# EAGLE design Backplane_extRefV3 (EAGLE 6.6.0)
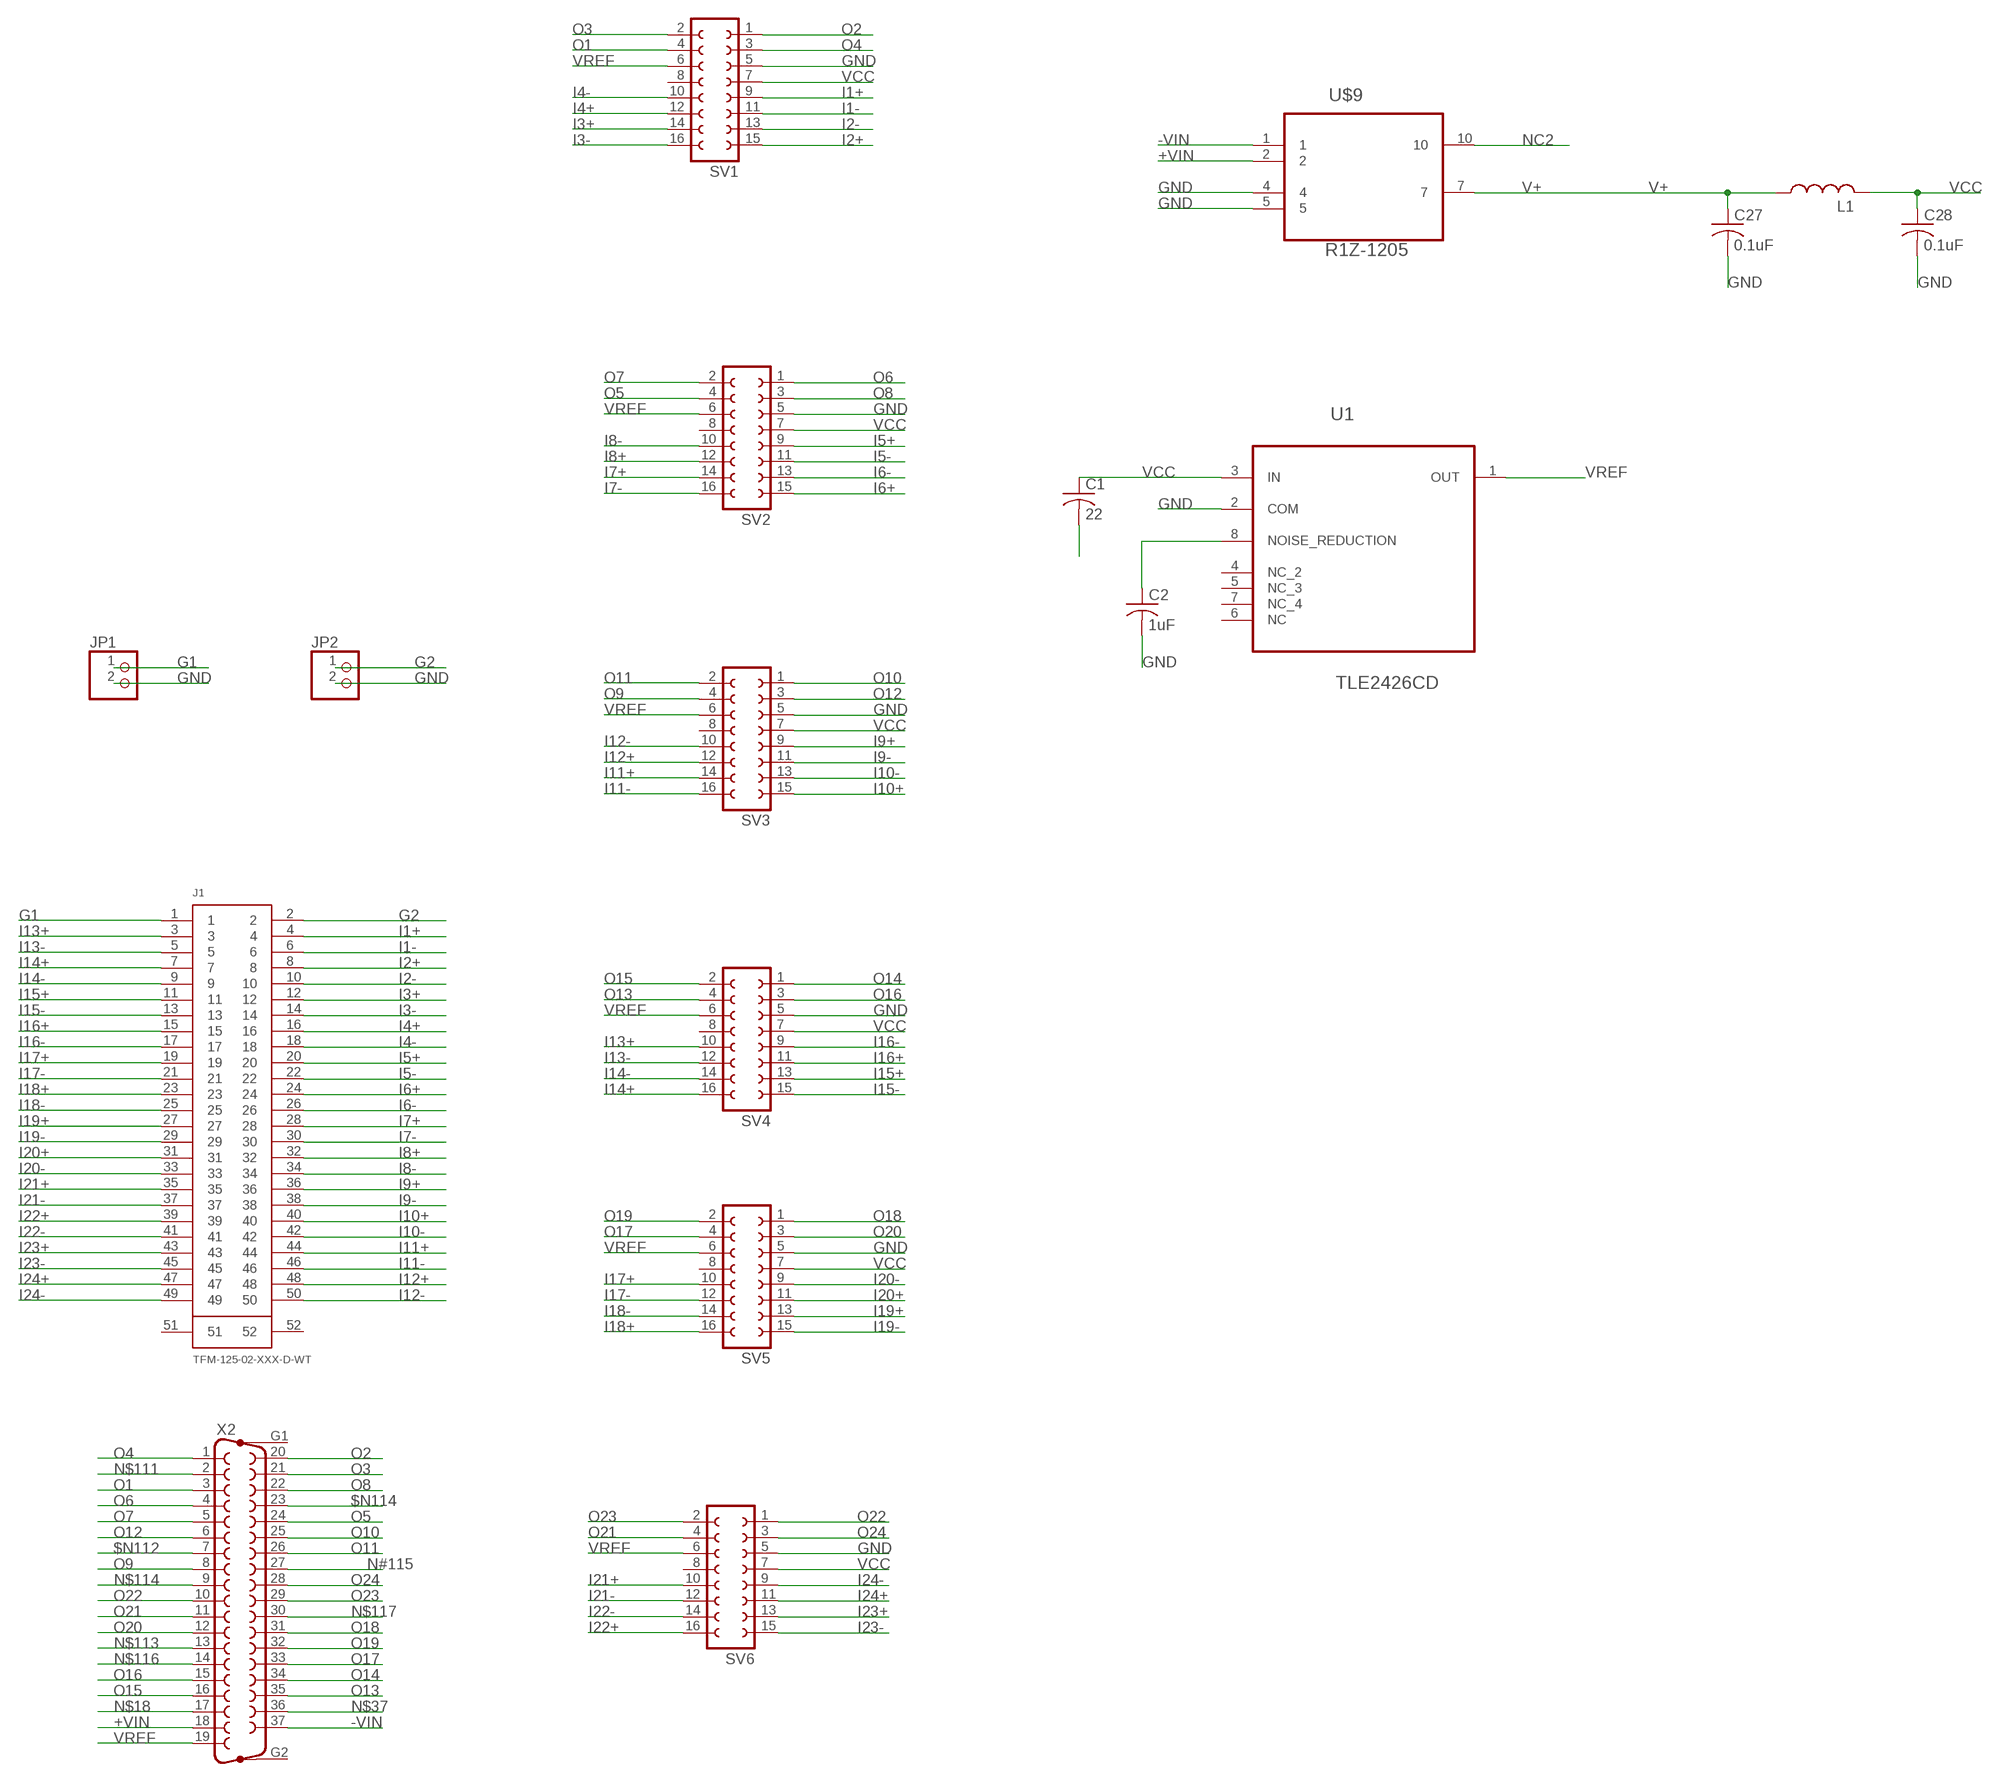
[diagram p0: schematic, sheet 1]

## Parts
C1  22  C-USC0805  [C0805]
C2  1uF  C-USC0805  [C0805]
C27  0.1uF  C-USC0805  [C0805]
C28  0.1uF  C-USC0805  [C0805]
J1  TFM-125-02-XXX-D-WT  [TFM-125-02-XXX-D-WT]
JP1  PINHD-1X2  [1X02]
JP2  PINHD-1X2  [1X02]
L1  L-USL3225M  [L3225M]
SV1  FE08-2  [FE08-2]
SV2  FE08-2  [FE08-2]
SV3  FE08-2  [FE08-2]
SV4  FE08-2  [FE08-2]
SV5  FE08-2  [FE08-2]
SV6  FE08-2  [FE08-2]
U1  TLE2426CD  [SOIC127P600X175-8N]
U$9  R1Z-1205  [R1Z-1205]
X2  F37HP  [F37HP]

## Nets
$N112: X2.7
$N114: X2.23
+VIN: U$9.2 X2.18
-VIN: U$9.1 X2.37
G1: J1.1 JP1.1
G2: J1.2 JP2.1
GND: C1.2 C2.2 C27.2 C28.2 JP1.2 JP2.2 SV1.5 SV2.5 SV3.5 SV4.5 SV5.5 SV6.5 U1.2(COM) U$9.4 U$9.5
I1+: J1.4 SV1.9
I1-: J1.6 SV1.11
I2+: J1.8 SV1.15
I2-: J1.10 SV1.13
I3+: J1.12 SV1.14
I3-: J1.14 SV1.16
I4+: J1.16 SV1.12
I4-: J1.18 SV1.10
I5+: J1.20 SV2.9
I5-: J1.22 SV2.11
I6+: J1.24 SV2.15
I6-: J1.26 SV2.13
I7+: J1.28 SV2.14
I7-: J1.30 SV2.16
I8+: J1.32 SV2.12
I8-: J1.34 SV2.10
I9+: J1.36 SV3.9
I9-: J1.38 SV3.11
I10+: J1.40 SV3.15
I10-: J1.42 SV3.13
I11+: J1.44 SV3.14
I11-: J1.46 SV3.16
I12+: J1.48 SV3.12
I12-: J1.50 SV3.10
I13+: J1.3 SV4.10
I13-: J1.5 SV4.12
I14+: J1.7 SV4.16
I14-: J1.9 SV4.14
I15+: J1.11 SV4.13
I15-: J1.13 SV4.15
I16+: J1.15 SV4.11
I16-: J1.17 SV4.9
I17+: J1.19 SV5.10
I17-: J1.21 SV5.12
I18+: J1.23 SV5.16
I18-: J1.25 SV5.14
I19+: J1.27 SV5.13
I19-: J1.29 SV5.15
I20+: J1.31 SV5.11
I20-: J1.33 SV5.9
I21+: J1.35 SV6.10
I21-: J1.37 SV6.12
I22+: J1.39 SV6.16
I22-: J1.41 SV6.14
I23+: J1.43 SV6.13
I23-: J1.45 SV6.15
I24+: J1.47 SV6.11
I24-: J1.49 SV6.9
N#115: X2.27
N$2: C2.1 U1.8(NOISE_REDUCTION)
N$18: X2.17
N$37: X2.36
N$111: X2.2
N$113: X2.13
N$114: X2.9
N$116: X2.14
N$117: X2.30
NC2: U$9.10
O1: SV1.4 X2.3
O2: SV1.1 X2.20
O3: SV1.2 X2.21
O4: SV1.3 X2.1
O5: SV2.4 X2.24
O6: SV2.1 X2.4
O7: SV2.2 X2.5
O8: SV2.3 X2.22
O9: SV3.4 X2.8
O10: SV3.1 X2.25
O11: SV3.2 X2.26
O12: SV3.3 X2.6
O13: SV4.4 X2.35
O14: SV4.1 X2.34
O15: SV4.2 X2.16
O16: SV4.3 X2.15
O17: SV5.4 X2.33
O18: SV5.1 X2.31
O19: SV5.2 X2.32
O20: SV5.3 X2.12
O21: SV6.4 X2.11
O22: SV6.1 X2.10
O23: SV6.2 X2.29
O24: SV6.3 X2.28
V+: C27.1 L1.1 U$9.7
VCC: C1.1 C28.1 L1.2 SV1.7 SV2.7 SV3.7 SV4.7 SV5.7 SV6.7 U1.3(IN)
VREF: SV1.6 SV2.6 SV3.6 SV4.6 SV5.6 SV6.6 U1.1(OUT) X2.19
Unconnected: J1.51 J1.52 SV1.8 SV2.8 SV3.8 SV4.8 SV5.8 SV6.8 U1.4(NC_2) U1.5(NC_3) U1.6(NC) U1.7(NC_4) X2.G1 X2.G2

## Library data of the parts
C1 C2 C27 C28 = rcl:C-US: CAPACITOR, American symbol
J1 = TFM-125-02-XXX-D-WT:TFM-125-02-XXX-D-WT: 0.050"X0.050" SURFACE MOUNT TERMINAL STRIP WITH DUAL WELD TAB.
JP1 JP2 = pinhead:PINHD-1X2: PIN HEADER
L1 = resistor:L-US: INDUCTOR, American symbol
SV1-SV6 = con-lsta:FE08-2: FEMALE HEADER; OC_FARNELL: unknown; OC_NEWARK: unknown
U1 = Texas Instruments_By_element14_Batch_1:TLE2426CD: PRECISION VIRTUAL GROUND; MPN: TLE2426CD; OC_FARNELL: 8454809; OC_NEWARK: 50B7917; PACKAGE: SOIC-8; SUPPLIER: Texas Instruments
U$9 = tuckerLib:R1Z-1205
X2 = con-subd:F37HP: SUB-D; OC_FARNELL: unknown; OC_NEWARK: unknown

## Board
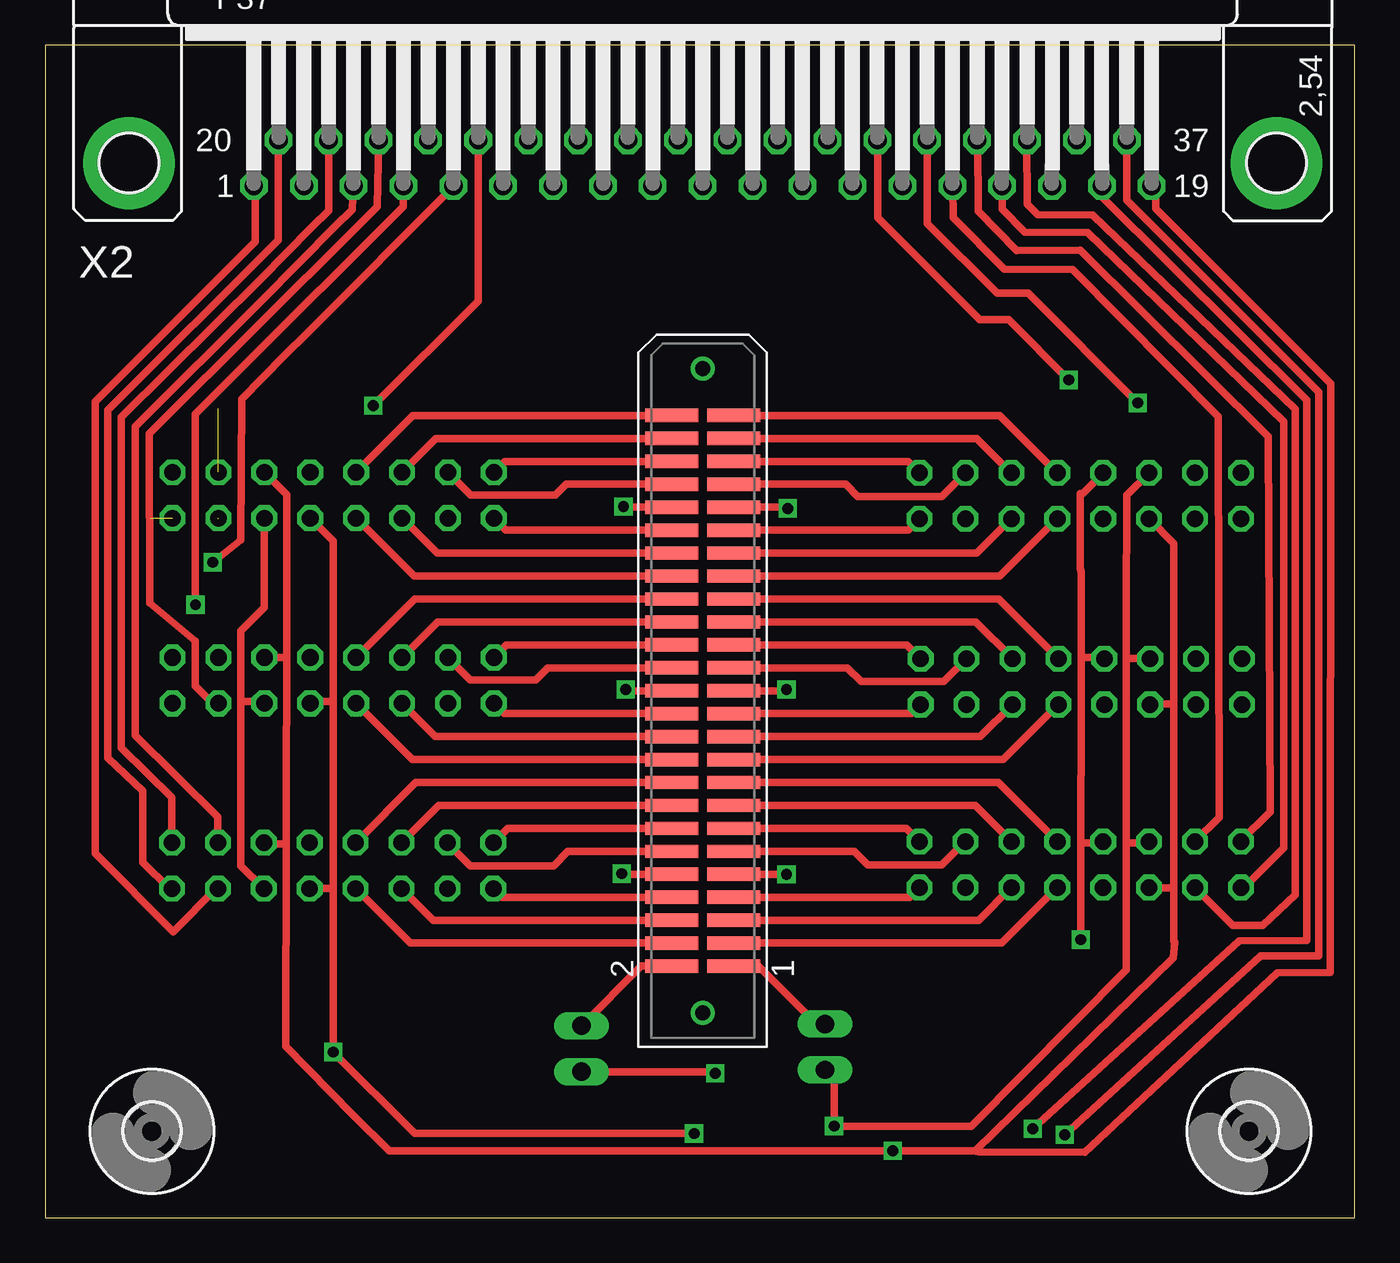
[diagram p1: board, top side]
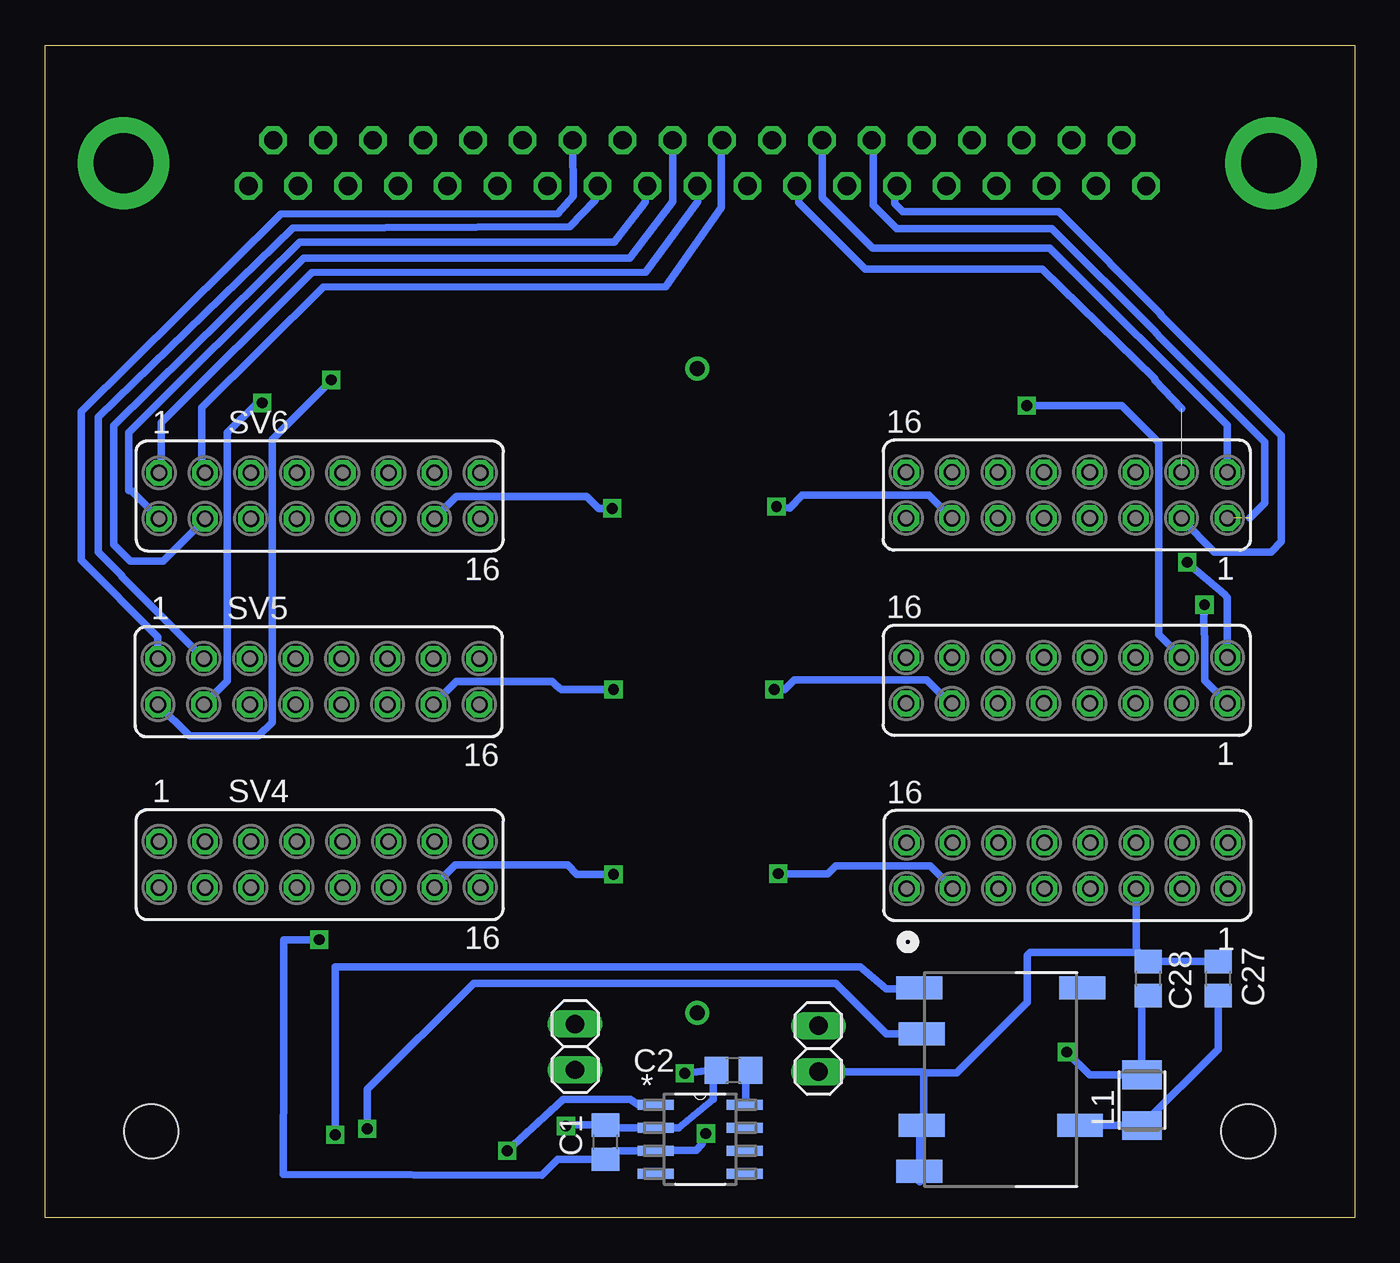
[diagram p2: board, bottom side, seen from below]

Size 72.47 x 64.92 mm. Coordinates in mm from the lower left corner, seen from the top.
Outline: 0,0 72.47,0 72.47,64.92 0,64.92 0,0
Copper layers (1*16): Top 0.035mm / dielectric 1.5mm / Bottom 0.035mm
Design rules "default *": minimum track width 10mil, minimum drill 10mil, track to track 8mil, track to pad 8mil, pad to pad 8mil, via to via 8mil, smd to smd 8mil, copper to edge 40mil, drill to drill 8mil, minimum pad ring 10mil, minimum via ring 8mil, stop-mask expansion 4mil, vias tented up to drill 0mil, thermal gap 10mil

### Footprints (pad centres in the part's own frame; a part is rotated, then mirrored left to right if it is on the bottom)
C0805 = smd 1.3 x 1.5: 1 -0.95,0; 2 0.95,0
TFM-125-02-XXX-D-WT = smd 0.737 x 2.921: 1 -15.24,-1.714; 2 -15.24,1.714; 3 -13.97,-1.714; 4 -13.97,1.714; 5 -12.7,-1.714; 6 -12.7,1.714; 7 -11.43,-1.714; 8 -11.43,1.714; 9 -10.16,-1.714; 10 -10.16,1.714; 11 -8.89,-1.714; 12 -8.89,1.714; 13 -7.62,-1.714; 14 -7.62,1.714; 15 -6.35,-1.714; 16 -6.35,1.714; 17 -5.08,-1.714; 18 -5.08,1.714; 19 -3.81,-1.714; 20 -3.81,1.714; 21 -2.54,-1.714; 22 -2.54,1.714; 23 -1.27,-1.714; 24 -1.27,1.714; 25 0,-1.714; 26 0,1.714; 27 1.27,-1.714; 28 1.27,1.714; 29 2.54,-1.714; 30 2.54,1.714; 31 3.81,-1.714; 32 3.81,1.714; 33 5.08,-1.714; 34 5.08,1.714; 35 6.35,-1.714; 36 6.35,1.714; 37 7.62,-1.714; 38 7.62,1.714; 39 8.89,-1.714; 40 8.89,1.714; 41 10.16,-1.714; 42 10.16,1.714; 43 11.43,-1.714; 44 11.43,1.714; 45 12.7,-1.714; 46 12.7,1.714; 47 13.97,-1.714; 48 13.97,1.714; 49 15.24,-1.714; 50 15.24,1.714 | drill 0.838: 51 -17.831,0; 52 17.831,0
1X02 = drill 1.016 long: 1 -1.27,0; 2 1.27,0
L3225M = smd 1.6 x 2.2: 1 -1.4,0; 2 1.4,0
FE08-2 = drill 0.914 octagon: 1 -8.89,1.27; 2 -8.89,-1.27; 3 -6.35,1.27; 4 -6.35,-1.27; 5 -3.81,1.27; 6 -3.81,-1.27; 7 -1.27,1.27; 8 -1.27,-1.27; 9 1.27,1.27; 10 1.27,-1.27; 11 3.81,1.27; 12 3.81,-1.27; 13 6.35,1.27; 14 6.35,-1.27; 15 8.89,1.27; 16 8.89,-1.27
SOIC127P600X175-8N = smd 1.981 x 0.559: 1 -2.464,1.905; 2 -2.464,0.635; 3 -2.464,-0.635; 4 -2.464,-1.905; 5 2.464,-1.905; 6 2.464,-0.635; 7 2.464,0.635; 8 2.464,1.905
3,0 = hole 3: 0,0
R1Z-1205 = smd 1.27 x 2.54: 1 -5.08,-5.207; 2 -2.54,-5.08; 4 2.54,-5.08; 5 5.08,-5.207; 7 2.54,3.683; 10 -5.08,3.81
F37HP = drill 1.016 octagon: 1 -24.841,-1.27; 2 -22.073,-1.27; 3 -19.329,-1.27; 4 -16.561,-1.27; 5 -13.792,-1.27; 6 -11.049,-1.27; 7 -8.28,-1.27; 8 -5.512,-1.27; 9 -2.769,-1.27; 10 0,-1.27; 11 2.769,-1.27; 12 5.512,-1.27; 13 8.28,-1.27; 14 11.049,-1.27; 15 13.818,-1.27; 16 16.561,-1.27; 17 19.329,-1.27; 18 22.098,-1.27; 19 24.841,-1.27; 20 -23.47,1.27; 21 -20.701,1.27; 22 -17.932,1.27; 23 -15.189,1.27; 24 -12.421,1.27; 25 -9.652,1.27; 26 -6.909,1.27; 27 -4.14,1.27; 28 -1.372,1.27; 29 1.372,1.27; 30 4.14,1.27; 31 6.909,1.27; 32 9.677,1.27; 33 12.421,1.27; 34 15.189,1.27; 35 17.958,1.27; 36 20.701,1.27; 37 23.47,1.27 | drill 3.302 pad 5.08: G1 -31.75,0; G2 31.75,0

### Placement (x,y rotation side)
C1  41.47,4.19 90 bottom
C2  34.39,8.16 180 bottom
C27  7.56,13.24 90 bottom
C28  11.43,13.24 90 bottom
J1  36.39,29.18 90 top
JP1  43.15,9.46 270 bottom
JP2  29.69,9.37 270 bottom
L1  11.78,6.51 90 bottom
SV1  15.91,19.49 180 bottom
SV2  15.94,29.75 180 bottom
SV3  15.94,40.01 180 bottom
SV4  57.28,19.56 0 bottom
SV5  57.34,29.69 0 bottom
SV6  57.28,39.97 0 bottom
U1  36.23,4.35 0 bottom
U$1  [3,0]  66.61,4.79 0 top
U$2  [3,0]  5.91,4.79 0 top
U$9  18.89,7.65 270 bottom
X2  36.39,58.39 0 top

### Tracks (layer width: path | path; a pad name or v marks a point on that pad's centre or on a via)
+VIN  (via drill 0.6)
  Top 0.406: X2.18 58.48,56.52 69.82,45.28 69.82,15.37 66.07,15.34 v54.64,4.92
  Bottom 0.406: v54.64,4.92 54.64,7.11 48.77,12.99 28.73,12.99 25.94,10.19 U$9.2
-VIN  (via drill 0.6)
  Top 0.406: X2.37 59.86,56.35 70.49,45.72 70.49,14.51 67.28,14.51 v56.42,4.6
  Bottom 0.406: v56.42,4.6 56.42,13.91 27.37,13.91 25.94,12.67 24.16,12.67 U$9.1
G1
  Top 0.406: J1.1 39.47,13.94 42.67,10.73 JP1.1 43.28,10.73 43.34,10.67 43.5,10.64
G2
  Top 0.406: JP2.1 32.99,13.94 J1.2
GND  (via drill 0.6)
  Top 0.406: 59.82,20.77 59.82,13.72 51.24,5.08 v43.66,5.08 43.66,7.81 43.28,8.19 JP1.2 | 59.82,20.77 59.82,30.96 | 59.82,30.96 59.82,33.69 59.86,39.82 59.86,40.01 SV6.5 | SV1.5 10.83,19.49 10.83,28.57 | 10.83,28.57 10.83,32.48 12.13,33.78 SV3.5 | SV2.5 12.03,28.57 10.83,28.57 | SV4.5 61.02,20.77 59.82,20.77 | SV5.5 59.82,30.96 | v37.08,8 36.99,8.1 JP2.2
  Bottom 0.406: v43.66,5.08 43.6,5.14 C1.2 41.31,4.99 U1.2 37.4,4.99 35.5,6.57 35.5,8.66 C2.2 35.94,8.13 v37.08,8 | 23.84,8.1 23.84,5.24 U$9.4 24.07,5.11 24.07,2 24.1,2.03 U$9.5 | 23.84,8.1 JP2.2 | 23.84,8.1 23.78,8.03 22.03,8.03 18.13,11.94 18.13,14.54 17.97,14.7 12.13,14.7 12.1,14.73 | 12.1,14.73 SV1.5 | C27.2 C28.2 11.97,14.73 12.1,14.73
I1+
  Top 0.406: SV1.9 20.19,15.21 J1.4
I1-
  Top 0.406: SV1.11 21.46,16.48 J1.6
I2+
  Top 0.406: SV1.15 25.27,17.75 J1.8
I2-  (via drill 0.6)
  Top 0.406: J1.10 31.94,19.02 v31.91,19.05
  Bottom 0.406: v31.91,19.05 29.18,19.05 28.73,19.49 23.49,19.49 22.26,18.26 SV1.13
I3+
  Top 0.406: SV1.14 23.53,19.49 28.13,19.49 28.92,20.29 J1.12
I3-
  Top 0.406: SV1.16 25.59,21.56 J1.14
I4+
  Top 0.406: SV1.12 21.78,22.83 J1.16
I4-
  Top 0.406: SV1.10 20.51,24.1 J1.18
I5+
  Top 0.406: SV2.9 20.32,25.37 J1.20
I5-
  Top 0.406: SV2.11 21.59,26.64 J1.22
I6+
  Top 0.406: SV2.15 25.4,27.91 J1.24
I6-  (via drill 0.6)
  Top 0.406: J1.26 32.19,29.18 v32.13,29.24
  Bottom 0.406: v32.13,29.24 31.56,29.24 31.02,29.78 23.69,29.78 22.38,28.48 SV2.13
I7+
  Top 0.406: SV2.14 23.53,29.78 27.15,29.78 27.81,30.45 J1.28
I7-
  Top 0.406: SV2.16 25.53,31.72 J1.30
I8+
  Top 0.406: SV2.12 21.72,32.99 J1.32
I8-
  Top 0.406: SV2.10 20.45,34.26 J1.34
I9+
  Top 0.406: SV3.9 20.42,35.53 J1.36
I9-
  Top 0.406: SV3.11 21.69,36.8 J1.38
I10+
  Top 0.406: SV3.15 25.5,38.07 J1.40
I10-  (via drill 0.6)
  Top 0.406: J1.42 32.42,39.34 v32,39.37
  Bottom 0.406: v32,39.37 31.27,39.31 30.58,40.01 23.59,40.01 22.32,38.73 SV3.13
I11+
  Top 0.406: SV3.14 23.56,40.01 28.23,40.01 28.83,40.61 J1.44
I11-
  Top 0.406: SV3.16 25.43,41.88 J1.46
I12+
  Top 0.406: SV3.12 21.62,43.15 J1.48
I12-
  Top 0.406: SV3.10 20.35,44.42 J1.50
I13+
  Top 0.406: SV4.10 52.93,15.21 J1.3
I13-
  Top 0.406: SV4.12 51.66,16.48 J1.5
I14+
  Top 0.406: SV4.16 47.85,17.75 J1.7
I14-  (via drill 0.6)
  Top 0.406: J1.9 v41.02,19.02
  Bottom 0.406: v41.02,19.02 43.05,19.02 43.56,19.53 49.78,19.53 50.93,18.38 SV4.14
I15+
  Top 0.406: SV4.13 49.63,19.53 45.53,19.53 44.77,20.29 J1.11
I15-
  Top 0.406: SV4.15 47.66,21.56 J1.13
I16+
  Top 0.406: SV4.11 51.47,22.83 J1.15
I16-
  Top 0.406: SV4.9 52.74,24.1 J1.17
I17+
  Top 0.406: SV5.10 53.02,25.37 J1.19
I17-
  Top 0.406: SV5.12 51.75,26.64 J1.21
I18+
  Top 0.406: SV5.16 47.94,27.91 J1.23
I18-  (via drill 0.6)
  Top 0.406: J1.25 40.93,29.18 v41.02,29.24
  Bottom 0.406: v41.02,29.24 43.91,29.24 44.16,29.43 44.42,29.69 49.72,29.69 SV5.14
I19+
  Top 0.406: SV5.13 49.72,29.69 45.15,29.69 44.39,30.45 J1.27
I19-
  Top 0.406: SV5.15 47.69,31.72 J1.29
I20+
  Top 0.406: SV5.11 51.5,32.99 J1.31
I20-
  Top 0.406: SV5.9 52.77,34.26 J1.33
I21+
  Top 0.406: SV6.10 52.83,35.53 J1.35
I21-
  Top 0.406: SV6.12 51.56,36.8 J1.37
I22+
  Top 0.406: SV6.16 47.75,38.07 J1.39
I22-  (via drill 0.6)
  Top 0.406: J1.41 41.02,39.34 v41.08,39.27
  Bottom 0.406: v41.08,39.27 41.85,39.27 42.51,39.94 49.72,39.94 50.93,38.73 SV6.14
I23+
  Top 0.406: SV6.13 49.63,39.94 44.96,39.94 44.29,40.61 J1.43
I23-
  Top 0.406: SV6.15 47.75,41.88 J1.45
I24+
  Top 0.406: SV6.11 51.56,43.15 J1.47
I24-
  Top 0.406: SV6.9 52.83,44.42 J1.49
N$2
  Bottom 0.406: C2.1 33.59,8.32 33.72,7.62 33.72,6.3 U1.8
O1
  Top 0.406: X2.3 16.99,55.82 16.07,54.9 12,50.8 4.98,43.81 4.98,26.7 9.56,22.19 SV1.4
O2
  Top 0.406: X2.20 12.89,59.63 12.89,54.13 3.46,44.7 3.46,25.46 5.4,23.62 5.4,19.68 6.86,18.22 SV1.1
O3
  Top 0.406: X2.21 15.68,55.75 14.76,54.83 11.94,51.98 4.22,44.32 4.22,26 7.02,23.27 SV1.2
O4
  Top 0.406: X2.1 11.62,57.04 11.62,54.04 2.76,45.18 2.76,20.16 7.08,15.84 9.46,18.22 SV1.3
O5  (via drill 0.6)
  Top 0.406: v18.16,44.96 23.96,50.76 X2.24
  Bottom 0.406: v18.16,44.96 12.89,44.96 10.86,42.93 10.86,32.29 SV2.4
O6  (via drill 0.6)
  Top 0.406: v8.32,33.94 8.32,44.48 12.54,48.74 17.91,54.07 19.81,55.98 19.81,57.11 X2.4
  Bottom 0.406: v8.32,33.94 8.35,33.21 8.32,31.94 8.32,29.75 SV2.1
O7  (via drill 0.6)
  Top 0.406: v9.27,36.29 10.83,37.53 10.89,45.34 13.24,47.72 14.51,48.99 22.61,57.11 X2.5
  Bottom 0.406: SV2.2 7.05,34.35 7.24,34.54 9.18,36.16 9.24,36.23 v9.27,36.29
O8
  Top 0.406: X2.22 18.38,55.98 16.89,54.48 12.1,49.72 5.75,43.4 5.78,34.04 8.32,31.94 8.32,29.43 9.27,28.48 SV2.3
O9  (1 unrouted)
  Bottom 0.406: 9.59,44.8 11.08,46.39 11.08,46.45 17.3,52.51 27.08,52.51 30.77,56.2 30.77,57.01 X2.8 30.86,57.11
O10  (1 unrouted)
  Bottom 0.406: X2.25 26.64,59.56 26.64,56.07 25.34,54.77 16.76,54.77 11.11,49.12 10.79,48.77 4.98,42.96 4.98,39.56 5.81,38.73
O11
  Bottom 0.406: 29.5,59.64 X2.26 29.46,59.65 29.46,56.48 26.67,53.69 16.89,53.69 7.08,43.91 7.05,43.88 SV3.2
O12  (1 unrouted)
  Top 0.406: 25.27,57.05 X2.6
  Bottom 0.406: 25.37,57.09 X2.6 25.46,56.99 25.46,56.13 25.02,55.69 16.38,55.69 10.73,50.04 10.73,49.97 4.06,43.31 4.06,37.43 4.64,36.86 7.78,36.86 9.59,38.67
O13
  Top 0.406: X2.35 54.32,59.64 54.36,56.1 54.93,55.53 57.98,55.5 69.18,44.77 69.18,17.88 67.37,16.19 65.72,16.19 SV4.4
O14
  Top 0.406: X2.34 51.59,59.64 51.63,55.72 53.75,53.53 57.28,53.56 67.69,43.24 67.79,22.48 66.17,20.86 SV4.1
O15
  Top 0.406: X2.16 52.96,57.11 52.96,55.85 54.2,54.58 57.69,54.55 68.55,44.07 68.55,20.48 66.36,18.29 SV4.2
O16
  Top 0.406: X2.15 50.23,57.09 50.26,55.37 53.09,52.51 56.86,52.48 64.93,44.35 64.96,22.38 64.96,22.16 SV4.3
O17  (via drill 0.6)
  Top 0.406: v60.45,45.12 54.39,51.18 52.67,51.18 48.81,55.05 X2.33
  Bottom 0.406: v60.45,45.12 60.74,45.12 62.39,43.47 62.39,29.72 SV5.4
O18
  Bottom 0.406: X2.31 43.28,59.64 43.24,56.55 44.1,55.59 59.44,55.56 70.49,44.64 70.49,36.42 66.23,32.16 SV5.1
O19  (via drill 0.6)
  Top 0.406: v56.64,46.39 53.31,49.72 51.72,49.72 46.06,55.38 X2.32
  Bottom 0.406: v56.64,46.39 56.64,46.35 59.91,43.09 59.91,27.43 60.67,26.67 64.48,26.67 SV5.2
O20
  Bottom 0.406: X2.12 41.91,57.11 42.04,56.33 43.43,54.86 58.77,54.8 69.53,44.32 69.53,36.86 68.23,35.56 68.23,35.5 SV5.3
O21
  Bottom 0.406: X2.11 39.18,57.09 39.27,56.23 40.99,54.01 58.39,54.01 68.68,43.85 68.68,37.27 67.75,36.35 65.94,36.35 63.63,38.67 SV6.4
O22
  Bottom 0.406: X2.10 36.35,56.26 39.24,52.36 57.72,52.32 66.04,44.04 66.04,41.37 SV6.1
O23
  Bottom 0.406: X2.29 37.75,56.26 40.13,53.12 58.17,53.12 67.85,43.47 67.85,40.26 67.72,40.26 SV6.2
O24
  Bottom 0.406: X2.28 35.05,59.62 35.05,55.91 38.13,51.56 57.09,51.53 63.81,44.86 63.81,41.43 SV6.3
V+
  Bottom 0.406: U$9.7 L1.1 7.56,9.33 C27.1
VCC  (via drill 0.6)
  Top 0.406: 15.94,28.57 15.94,37.47 SV3.7 | 57.34,31.02 57.34,24.57 57.31,24.38 57.31,20.77 | 57.34,31.02 57.34,35.72 57.28,35.97 57.28,40.1 57.4,40.1 SV6.7 | v57.31,15.4 57.31,20.77 | 15.94,18.22 v15.94,9.18 20.45,4.67 v35.91,4.67 | 15.94,28.57 15.94,18.22 | SV1.7 15.94,18.22 | SV2.7 14.76,28.57 15.94,28.57 | SV4.7 58.48,20.77 57.31,20.77 | SV5.7 58.55,31.02 57.34,31.02
  Bottom 0.406: v35.91,4.67 36.16,4.03 36.45,3.75 38.66,3.75 U1.3 40.99,3.71 C1.1 44.1,3.24 44.99,2.35 59.31,2.41 59.28,9.08 59.28,15.4 v57.31,15.4 | C28.1 11.78,11.94 L1.2 14.67,7.91 v15.94,9.18
VREF  (via drill 0.6)
  Top 0.406: 13.33,20.7 13.3,9.49 17.02,5.71 19.05,3.71 v46.89,3.71 51.24,3.71 | 13.33,20.7 13.34,23.46 13.36,31.02 | 62.45,18.26 62.45,15.3 62.52,15.27 62.42,14.38 55.77,7.93 | 62.45,18.26 62.45,28.45 | 62.45,28.45 62.45,37.34 SV6.6 | 51.24,3.71 51.47,3.71 55.77,7.93 | X2.19 61.23,56.88 61.47,56.64 61.47,55.88 71.15,46.2 71.12,13.59 68.17,13.56 57.53,3.62 51.66,3.65 51.24,3.71 | 55.81,7.97 55.77,7.93 | 13.36,31.02 13.37,35.18 13.37,40.04 SV3.6 | SV1.6 12.16,20.7 13.33,20.7 | SV2.6 13.36,31.02 | SV4.6 61.12,18.26 62.45,18.26 | SV5.6 61.18,28.45 62.45,28.45
  Bottom 0.406: U1.1 39.66,6.25 40.1,6.57 43.82,6.57 v46.89,3.71